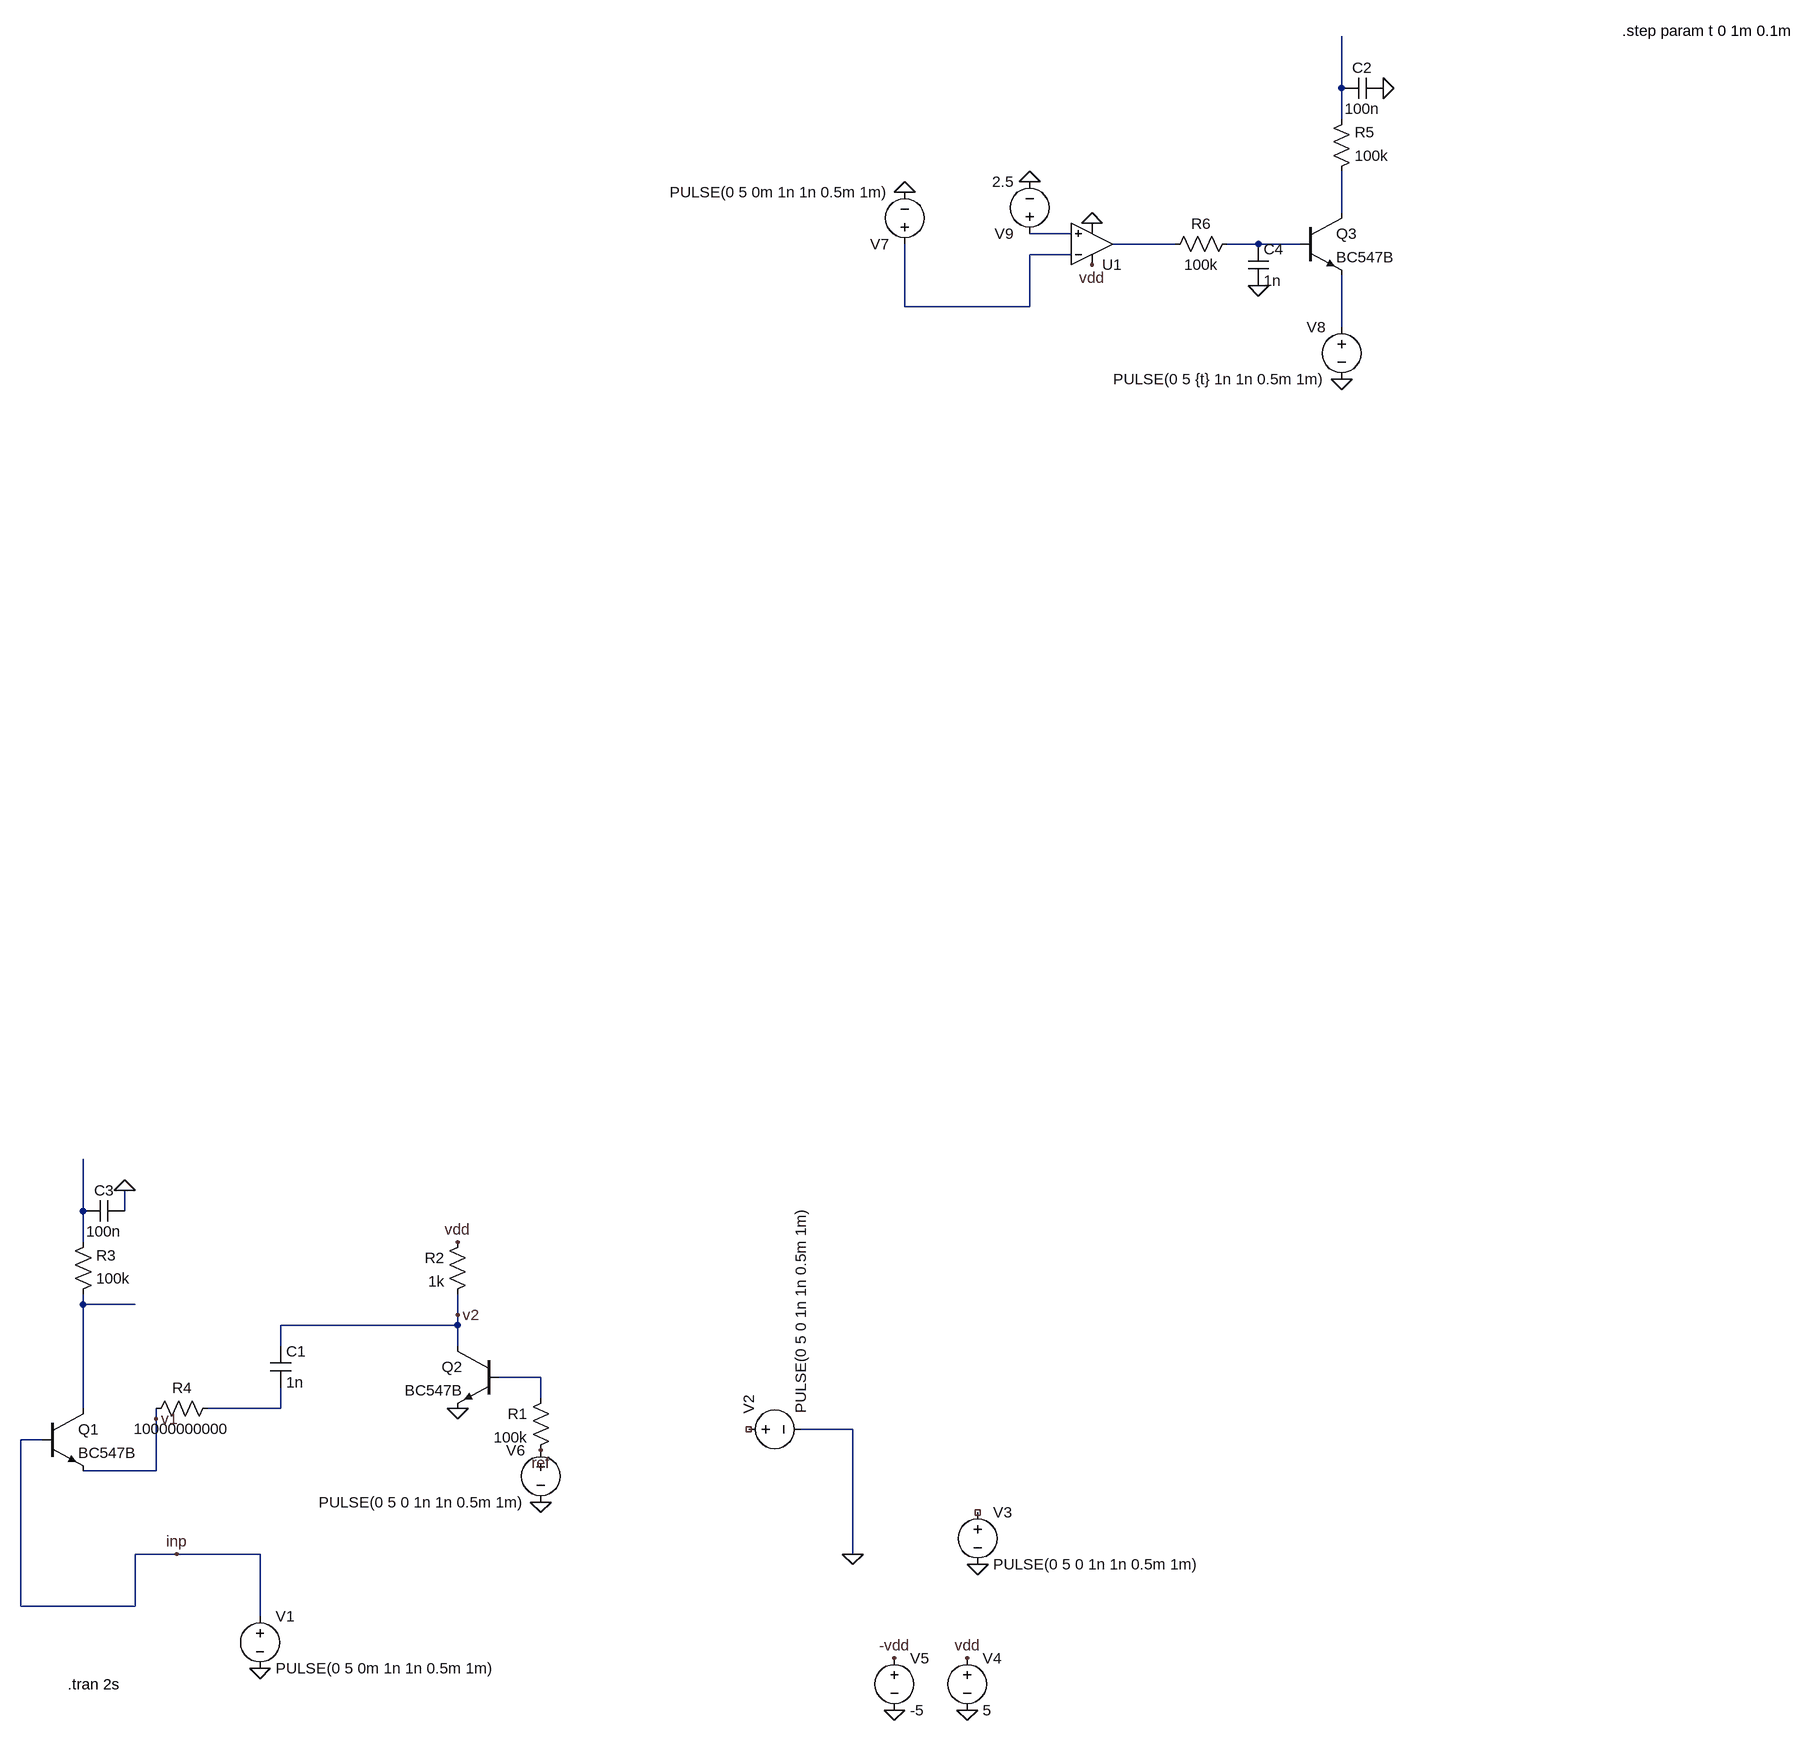
[diagram p0: schematic BJT_PD.asc]
BJT_PD.asc, the LTspice schematic file:
Version 4.1
SHEET 1 2868 680
WIRE 2128 -2224 2128 -2304
WIRE 2128 -2176 2128 -2224
WIRE 2128 -2032 2128 -2096
WIRE 1712 -2000 1648 -2000
WIRE 1872 -1984 1776 -1984
WIRE 2000 -1984 1952 -1984
WIRE 2064 -1984 2000 -1984
WIRE 1712 -1968 1648 -1968
WIRE 1456 -1888 1456 -1984
WIRE 1648 -1888 1648 -1968
WIRE 1648 -1888 1456 -1888
WIRE 2128 -1856 2128 -1936
WIRE 192 -496 192 -576
WIRE 256 -496 256 -528
WIRE 192 -448 192 -496
WIRE 192 -352 192 -368
WIRE 272 -352 192 -352
WIRE 768 -336 768 -368
WIRE 768 -320 768 -336
WIRE 768 -320 496 -320
WIRE 496 -288 496 -320
WIRE 768 -288 768 -320
WIRE 896 -240 832 -240
WIRE 896 -208 896 -240
WIRE 192 -192 192 -352
WIRE 496 -192 496 -224
WIRE 496 -192 384 -192
WIRE 304 -176 304 -192
WIRE 1376 -160 1296 -160
WIRE 128 -144 96 -144
WIRE 304 -96 304 -176
WIRE 304 -96 192 -96
WIRE 336 32 272 32
WIRE 464 32 336 32
WIRE 1376 32 1376 -160
WIRE 96 112 96 -144
WIRE 272 112 272 32
WIRE 272 112 96 112
WIRE 464 128 464 32
FLAG 464 208 0
FLAG 256 -528 0
FLAG 1376 32 0
FLAG 1568 48 0
FLAG 1552 272 0
FLAG 1552 192 vdd
FLAG 1440 272 0
FLAG 1440 192 -vdd
FLAG 896 -48 0
FLAG 768 -192 0
FLAG 768 -448 vdd
FLAG 768 -336 v2
FLAG 304 -176 v1
FLAG 896 -128 ref
FLAG 336 32 inp
FLAG 1456 -2064 0
FLAG 2128 -1776 0
FLAG 1744 -2016 0
FLAG 1744 -1952 vdd
FLAG 1648 -2080 0
FLAG 2000 -1920 0
FLAG 2192 -2224 0
SYMBOL voltage 464 112 R0
WINDOW 123 0 0 Left 0
WINDOW 39 0 0 Left 0
SYMATTR InstName V1
SYMATTR Value PULSE(0 5 0m 1n 1n 0.5m 1m)
SYMBOL npn 128 -192 R0
SYMATTR InstName Q1
SYMATTR Value BC547B
SYMBOL voltage 1200 -160 R270
WINDOW 123 0 0 Left 0
WINDOW 39 0 0 Left 0
SYMATTR InstName V2
SYMATTR Value PULSE(0 5 0 1n 1n 0.5m 1m)
SYMBOL res 176 -352 M180
WINDOW 0 36 76 Left 2
WINDOW 3 36 40 Left 2
SYMATTR InstName R3
SYMATTR Value 100k
SYMBOL cap 256 -480 M270
WINDOW 0 32 32 VTop 2
WINDOW 3 0 32 VBottom 2
SYMATTR InstName C3
SYMATTR Value 100n
SYMBOL voltage 1568 -48 R0
WINDOW 123 0 0 Left 0
WINDOW 39 0 0 Left 0
SYMATTR InstName V3
SYMATTR Value PULSE(0 5 0 1n 1n 0.5m 1m)
SYMBOL voltage 1552 176 R0
WINDOW 123 0 0 Left 0
WINDOW 39 0 0 Left 0
SYMATTR InstName V4
SYMATTR Value 5
SYMBOL voltage 1440 176 R0
WINDOW 123 0 0 Left 0
WINDOW 39 0 0 Left 0
SYMATTR InstName V5
SYMATTR Value -5
SYMBOL voltage 896 -144 M0
WINDOW 123 0 0 Left 0
WINDOW 39 0 0 Left 0
SYMATTR InstName V6
SYMATTR Value PULSE(0 5 0 1n 1n 0.5m 1m)
SYMBOL npn 832 -288 M0
SYMATTR InstName Q2
SYMATTR Value BC547B
SYMBOL res 912 -224 M0
SYMATTR InstName R1
SYMATTR Value 100k
SYMBOL res 784 -464 M0
SYMATTR InstName R2
SYMATTR Value 1k
SYMBOL res 400 -208 R90
WINDOW 0 0 56 VBottom 2
WINDOW 3 32 56 VTop 2
SYMATTR InstName R4
SYMATTR Value 10000000000
SYMBOL cap 480 -288 R0
SYMATTR InstName C1
SYMATTR Value 1n
SYMBOL voltage 1456 -1968 R180
WINDOW 123 0 0 Left 0
WINDOW 39 0 0 Left 0
SYMATTR InstName V7
SYMATTR Value PULSE(0 5 0m 1n 1n 0.5m 1m)
SYMBOL npn 2064 -2032 R0
SYMATTR InstName Q3
SYMATTR Value BC547B
SYMBOL res 2112 -2080 M180
WINDOW 0 36 76 Left 2
WINDOW 3 36 40 Left 2
SYMATTR InstName R5
SYMATTR Value 100k
SYMBOL cap 2192 -2208 M270
WINDOW 0 32 32 VTop 2
WINDOW 3 0 32 VBottom 2
SYMATTR InstName C2
SYMATTR Value 100n
SYMBOL voltage 2128 -1872 M0
WINDOW 123 0 0 Left 0
WINDOW 39 0 0 Left 0
SYMATTR InstName V8
SYMATTR Value PULSE(0 5 {t} 1n 1n 0.5m 1m)
SYMBOL OpAmps\\UniversalOpAmp2 1744 -1984 M180
SYMATTR InstName U1
SYMATTR Value2 Avol=100Meg GBW=10Meg Slew=10Meg
SYMBOL voltage 1648 -1984 R180
WINDOW 123 0 0 Left 0
WINDOW 39 0 0 Left 0
SYMATTR InstName V9
SYMATTR Value 2.5
SYMBOL res 1968 -2000 R90
WINDOW 0 0 56 VBottom 2
WINDOW 3 32 56 VTop 2
SYMATTR InstName R6
SYMATTR Value 100k
SYMBOL cap 1984 -1984 R0
SYMATTR InstName C4
SYMATTR Value 1n
TEXT 168 232 Left 2 !.tran 2s
TEXT 2560 -2312 Left 2 !.step param t 0 1m 0.1m

The netlist it stands for:
* BJT_PD.asc
V1 inp 0 PULSE(0 5 0m 1n 1n 0.5m 1m)
Q1 N009 inp v1 0 BC547B
V2 NC_01 0 PULSE(0 5 0 1n 1n 0.5m 1m)
R3 N009 N008 100k
C3 0 N008 100n
V3 NC_02 0 PULSE(0 5 0 1n 1n 0.5m 1m)
V4 vdd 0 5
V5 -vdd 0 -5
V6 ref 0 PULSE(0 5 0 1n 1n 0.5m 1m)
Q2 v2 N010 0 0 BC547B
R1 N010 ref 100k
R2 vdd v2 1k
R4 N011 v1 10000000000
C1 v2 N011 1n
V7 N006 0 PULSE(0 5 0m 1n 1n 0.5m 1m)
Q3 N002 N005 N007 0 BC547B
R5 N002 N001 100k
C2 0 N001 100n
V8 N007 0 PULSE(0 5 {t} 1n 1n 0.5m 1m)
X§U1 N003 N006 vdd 0 N004 level2 Avol=100Meg GBW=10Meg Slew=10Meg Ilimit=25m Rail=0 Vos=0 En=0 Enk=0 In=0 Ink=0 Rin=500Meg  ; pins In+ In- V+ V- OUT
V9 N003 0 2.5
R6 N005 N004 100k
C4 N005 0 1n
.model NPN NPN
.model PNP PNP
.lib standard.bjt
.tran 2s
.step param t 0 1m 0.1m
.lib UniversalOpAmp2.lib
.backanno
.end